# EAGLE design Adafruit Flora TSL2561 Lux (EAGLE 6.3)
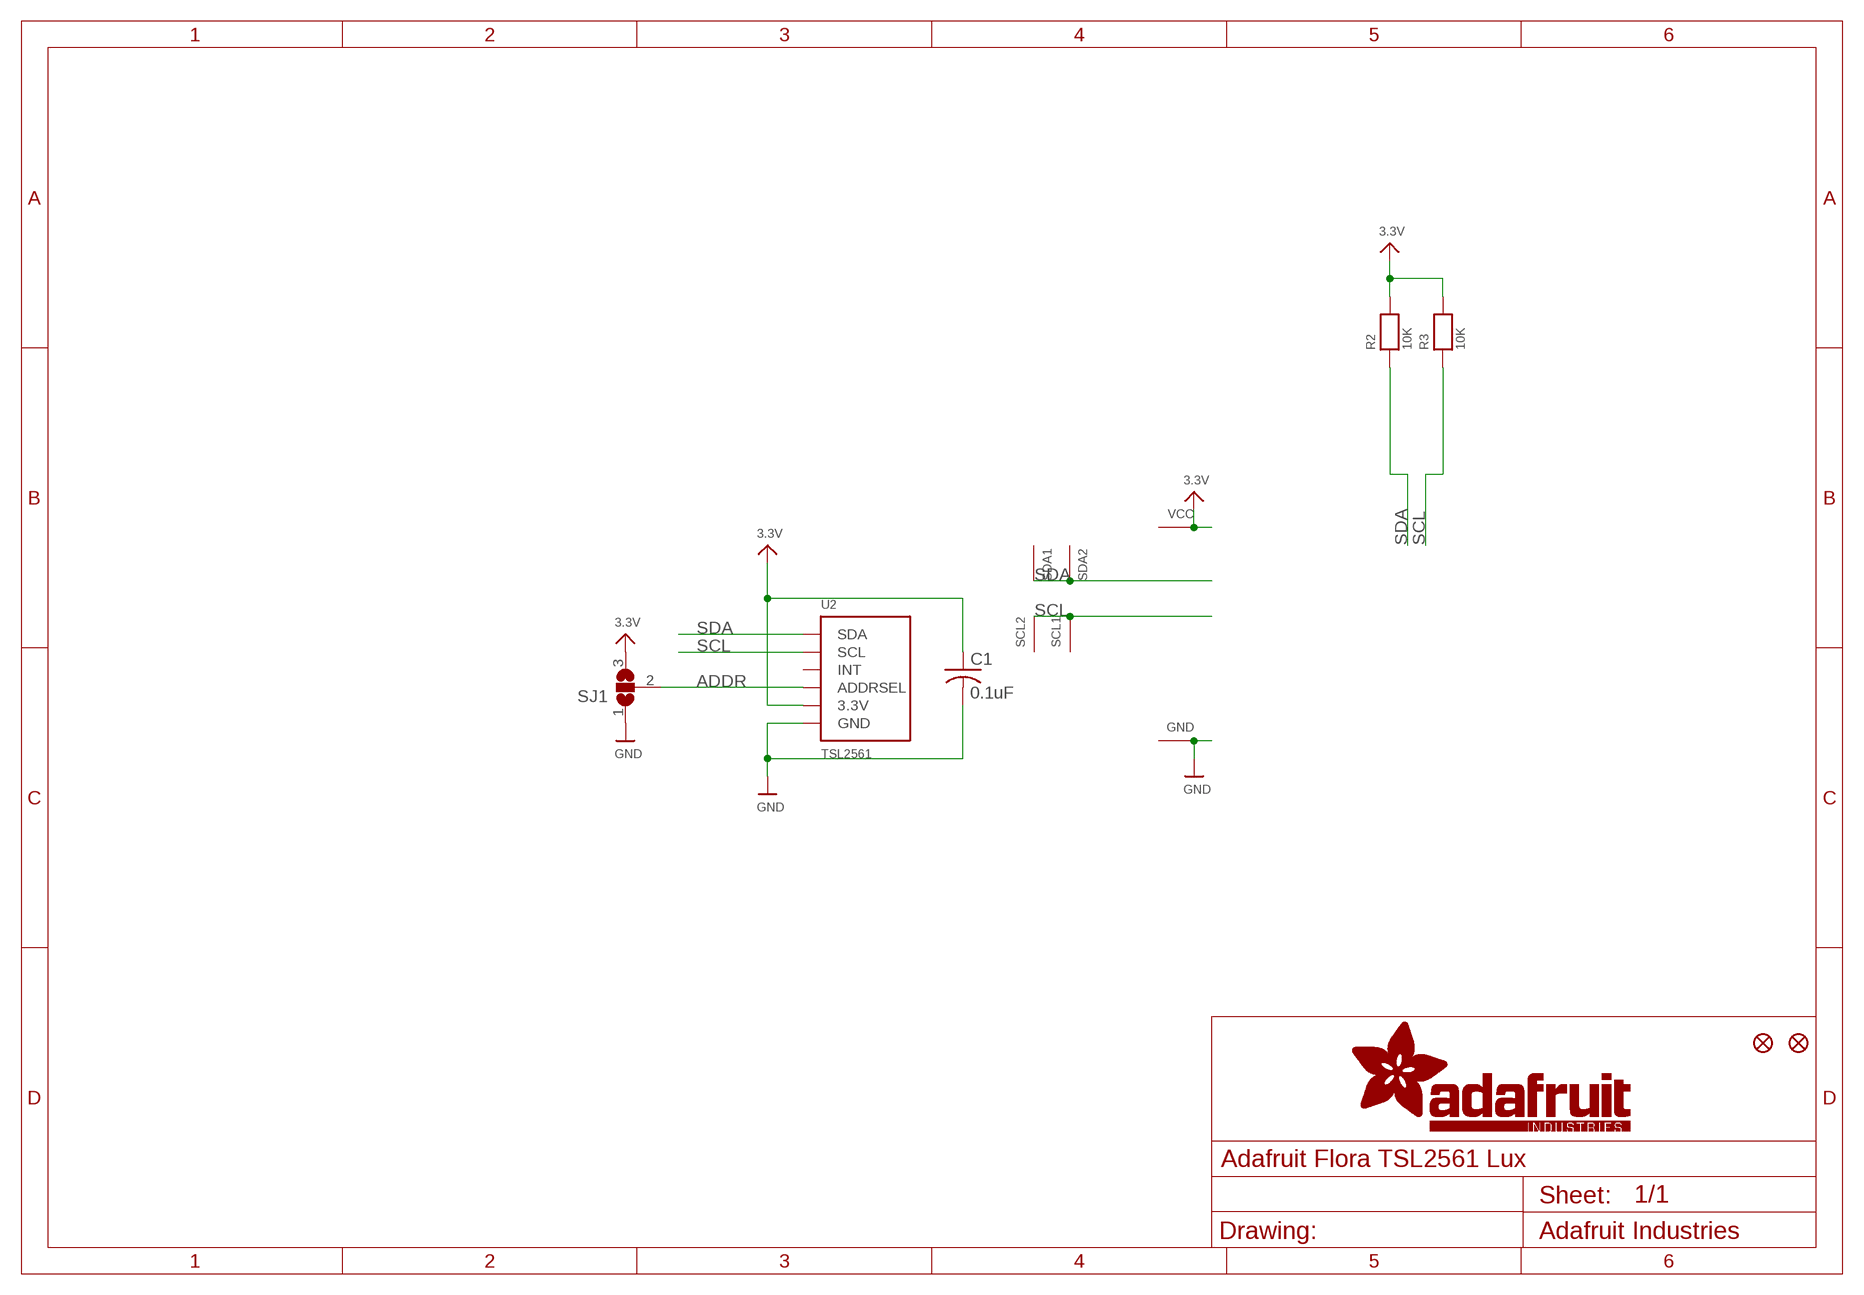
[diagram p0: schematic, sheet 1]

## Parts
C1  0.1uF  C-USC0805K  [C0805K]
FID1  FIDUCIAL""  [FIDUCIAL_1MM]
FID2  FIDUCIAL""  [FIDUCIAL_1MM]
GND  SEWTAP0.5IN  [SEWINGTAP_0.5]
R2  10K  RESISTOR_0805  [_0805]
R3  10K  RESISTOR_0805  [_0805]
SCL1  SEWTAP0.5IN  [SEWINGTAP_0.5]
SCL2  SEWTAP0.5IN  [SEWINGTAP_0.5]
SDA1  SEWTAP0.5IN  [SEWINGTAP_0.5]
SDA2  SEWTAP0.5IN  [SEWINGTAP_0.5]
SJ1  SJ2W  [SJ_2]
U2  TSL2561  [TSL2561_FN]
VCC  SEWTAP0.5IN  [SEWINGTAP_0.5]

## Nets
3.3V: C1.1 R2.2 R3.2 SJ1.3 U2.VDD(3.3V) VCC.TAP(SEW)
ADDR: SJ1.2 U2.ADR(ADDRSEL)
GND: C1.2 GND.TAP(SEW) SJ1.1 U2.VSS(GND)
SCL: R3.1 SCL1.TAP(SEW) SCL2.TAP(SEW) U2.CLK(SCL)
SDA: R2.1 SDA1.TAP(SEW) SDA2.TAP(SEW) U2.DATA(SDA)
Unconnected: U2.INT

## Library data of the parts
C1 = adafruit:C-US: CAPACITOR, American symbol
FID1 FID2 = microbuilder:FIDUCIAL: Fiducial Alignment Points Various fiducial points for machine vision alignment.; BOM: EXCLUDE
GND SCL1 SCL2 SDA1 SDA2 VCC = adafruit:SEWTAP
R2 R3 = microbuilder:RESISTOR: Resistors For new designs, use the packages preceded by an '_' character since they are more reliable: The following footprints should be used on most boards: _0402 - Standard footprint for regular board layouts _0603 - Standard footprint for regular board layouts _0805 - Standard footprint for regular board layouts For extremely tight-pitch boards where space is at a premium, the following 'micro-pitch' footprints can be used (smaller pads, no silkscreen outline, etc.): _0402MP - Micro-pitch footprint for very dense/compact boards _0603MP - Micro-pitch footprint for very dense/compact boards _0805MP - Micro-pitch footprint for very dense/compact boards
SJ1 = jumper:SJ2W: SMD solder JUMPER
U2 = microbuilder:TSL2561: TSL2561 Light-To-Digital Sensor Mouser Part Numbers: CS (obsolete): 856-TSL2561CS DFN (cheapest): 856-TSL2561FN

## Board
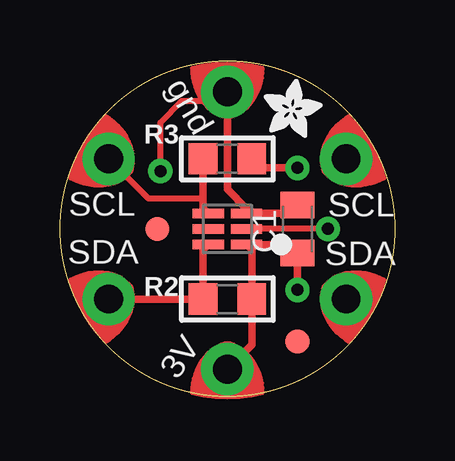
[diagram p1: board, top side]
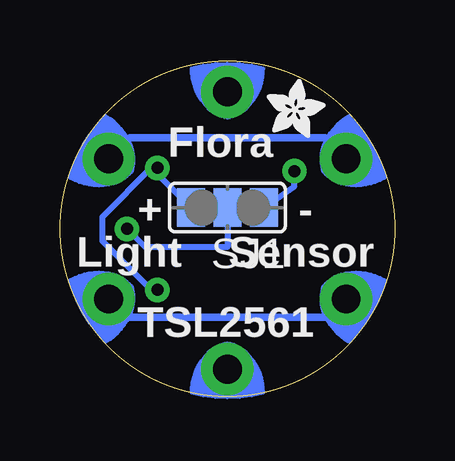
[diagram p2: board, bottom side, seen from below]

Size 13.97 x 13.97 mm. Coordinates in mm from the lower left corner, seen from the top.
Outline: circle at 6.99,6.99 radius 6.99
Copper layers (1*16): Top 0.035mm / dielectric 1.5mm / Bottom 0.035mm
Design rules "default": minimum track width 8mil, minimum drill 0.4mm, track to track 8mil, track to pad 8mil, pad to pad 8mil, via to via 8mil, smd to smd 8mil, copper to edge 20mil, drill to drill 8mil, minimum pad ring 8mil, minimum via ring 10mil, stop-mask expansion 3mil, vias tented up to drill 20mil, thermal gap 8mil

### Footprints (pad centres in the part's own frame; a part is rotated, then mirrored left to right if it is on the bottom)
C0805K = smd 1.1 x 1.4: 1 -1,0; 2 1,0
FIDUCIAL_1MM = smd 1 x 1: 1 0,0
SEWINGTAP_0.5 = drill 1.2 pad 2.184: TAP 0,0
_0805 = smd 1.2 x 1.3: 1 -1.016,0; 2 1.016,0
SJ_2 = smd 1.168 x 1.6: 1 -1.524,0; 2 0,0; 3 1.524,0
TSL2561_FN = smd 1.3 x 0.4: ADR -0.8,0; CLK 0.8,-0.65; DATA 0.8,0.65; INT 0.8,0; VDD -0.8,0.65; VSS -0.8,-0.65

### Placement (x,y rotation side)
C1  9.91,6.99 90 top
FID1  4.06,6.99 0 top
FID2  9.91,2.29 0 top
GND  6.99,12.7 0 top
R2  6.99,4.06 0 top
R3  6.99,9.91 0 top
SCL1  11.94,9.91 300 top
SCL2  2.03,9.91 60 top
SDA1  11.94,4.06 240 top
SDA2  2.03,4.06 120 top
SJ1  6.99,7.87 180 bottom
U2  6.99,6.99 180 top
U$3  [ADAFRUIT_2.5MM]  5.33,10.79 0 bottom
U$4  [ADAFRUIT_2.5MM]  8.51,10.79 0 top
VCC  6.99,1.14 180 top

### Tracks (layer width: path | path; a pad name or v marks a point on that pad's centre or on a via)
3.3V  (via drill 0.5)
  Top 0.305: VCC.TAP 8,2.16 R2.2 8,6.12 U2.VDD 9.55,6.33 C1.1 v9.91,4.45 | R3.2 8.38,9.53 v9.91,9.53
  Bottom 0.254: v9.91,4.45 10.16,4.45 12.19,6.48 12.19,7.49 10.16,9.53 v9.91,9.53 9.91,9.27 SJ1.3
ADDR  (via drill 0.5)
  Top 0.254: v11.18,6.99 U2.ADR
  Bottom 0.254: SJ1.2 6.99,6.22 10.41,6.22 v11.18,6.99
GND  (via drill 0.5)
  Top 0.254: v4.19,9.4 4.19,11.43 5.08,12.32 6.6,12.32 GND.TAP
  Top 0.305: GND.TAP 6.99,8.64 7.79,7.84 U2.VSS 9.71,7.64 C1.2
  Bottom 0.254: SJ1.1 4.19,8.76 v4.19,9.4
SCL
  Top 0.254: SCL2.TAP 3.68,8.26 5.97,8.26
  Top 0.305: U2.CLK 5.97,7.85 5.97,8.26 R3.1
  Bottom 0.305: SCL1.TAP 11.05,10.79 2.92,10.79 SCL2.TAP
SDA
  Top 0.305: U2.DATA 5.97,6.12 R2.1 SDA2.TAP
  Bottom 0.305: SDA2.TAP 2.79,3.3 11.18,3.3 SDA1.TAP

### Text on the board
tPlace: gnd | SCL | SCL | SDA | SDA | 3V
bPlace: Flora | - | + | Sensor | Light | TSL2561